# Altium schematic sheet PIN-HEADERS.SchDoc
size A; SheetNumber: 8; SheetTotal: 8
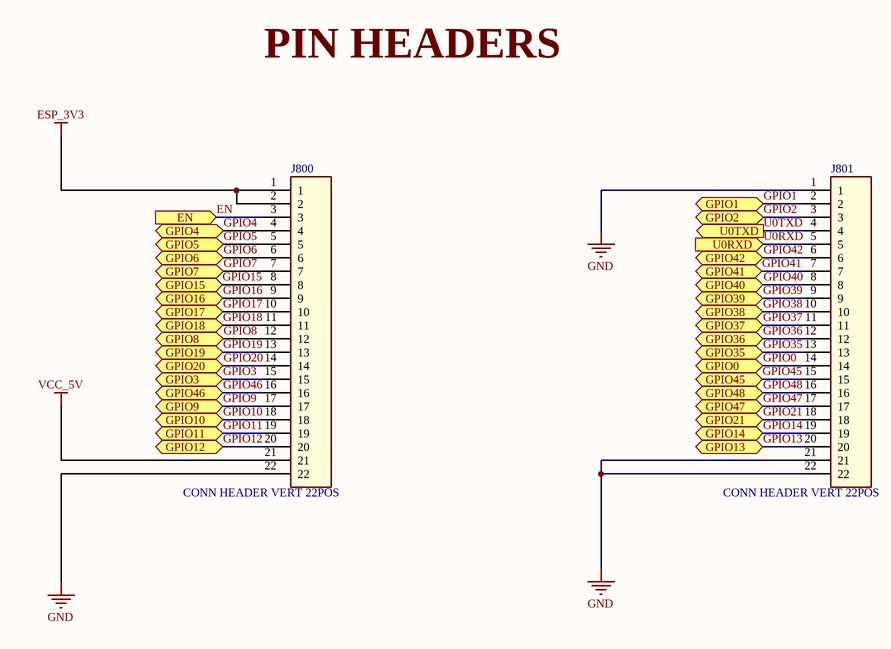
[diagram p0: PIN-HEADERS.SchDoc]

## Parts
J800  CONN HEADER VERT 22POS  [CON22_1X22_TU_TSW]
J801  CONN HEADER VERT 22POS  [CON22_1X22_TU_TSW]

## Ports
EN (in, see AUTO_PROGRAMMING[4B], ESP32-S3-WROOM-1U[2B], POWER[2C]), GPIO0 (bidir, see AUTO_PROGRAMMING[4C], ESP32-S3-WROOM-1U[4C], POWER[3C]), GPIO1 (bidir, see ESP32-S3-WROOM-1U[4B]), GPIO2 (bidir, see ESP32-S3-WROOM-1U[4B]), GPIO3 (bidir, see ESP32-S3-WROOM-1U[3A]), GPIO4 (bidir, see ESP32-S3-WROOM-1U[2B]), GPIO5 (bidir, see ESP32-S3-WROOM-1U[2B]), GPIO6 (bidir, see ESP32-S3-WROOM-1U[2B]), GPIO7 (bidir, see ESP32-S3-WROOM-1U[2B]), GPIO8 (bidir, see ESP32-S3-WROOM-1U[2B]), GPIO9 (bidir, see ESP32-S3-WROOM-1U[3A]), GPIO10 (bidir, see ESP32-S3-WROOM-1U[3A]), GPIO11 (bidir, see ESP32-S3-WROOM-1U[3A]), GPIO12 (bidir, see ESP32-S3-WROOM-1U[3A]), GPIO13 (bidir, see ESP32-S3-WROOM-1U[3A]), GPIO14 (bidir, see ESP32-S3-WROOM-1U[3A]), GPIO15 (bidir, see ESP32-S3-WROOM-1U[2B]), GPIO16 (bidir, see ESP32-S3-WROOM-1U[2B]), GPIO17 (bidir, see ESP32-S3-WROOM-1U[2B]), GPIO18 (bidir, see ESP32-S3-WROOM-1U[2B]), GPIO19 (bidir, see ESP32-S3-WROOM-1U[2B], USB[4A]), GPIO20 (bidir, see ESP32-S3-WROOM-1U[2C], USB[4A]), GPIO21 (bidir, see ESP32-S3-WROOM-1U[3A]), GPIO35 (bidir, see ESP32-S3-WROOM-1U[4B]), GPIO36 (bidir, see ESP32-S3-WROOM-1U[4B]), GPIO37 (bidir, see ESP32-S3-WROOM-1U[4B]), GPIO38 (bidir, see ESP32-S3-WROOM-1U[4B], RGB_LED[2B]), GPIO39 (bidir, see ESP32-S3-WROOM-1U[4B]), GPIO40 (bidir, see ESP32-S3-WROOM-1U[4B]), GPIO41 (bidir, see ESP32-S3-WROOM-1U[4B]), GPIO42 (bidir, see ESP32-S3-WROOM-1U[4B]), GPIO45 (bidir, see ESP32-S3-WROOM-1U[3A]), GPIO46 (bidir, see ESP32-S3-WROOM-1U[3A]), GPIO47 (bidir, see ESP32-S3-WROOM-1U[3A]), GPIO48 (bidir, see ESP32-S3-WROOM-1U[3A]), U0RXD (in, see ESP32-S3-WROOM-1U[4B], USB_TO_UART_CONVERTER[4A]), U0TXD (out, see ESP32-S3-WROOM-1U[4B], USB_TO_UART_CONVERTER[4A])

## Nets
ESP_3V3: J800.1 J800.2
GND: J800.22 J801.1 J801.21 J801.22
VCC_5V: J800.21
EN: J800.3 ; port EN
GPIO0: J801.14 ; port GPIO0
GPIO1: J801.2 ; port GPIO1
GPIO2: J801.3 ; port GPIO2
GPIO3: J800.15 ; port GPIO3
GPIO4: J800.4 ; port GPIO4
GPIO5: J800.5 ; port GPIO5
GPIO6: J800.6 ; port GPIO6
GPIO7: J800.7 ; port GPIO7
GPIO8: J800.12 ; port GPIO8
GPIO9: J800.17 ; port GPIO9
GPIO10: J800.18 ; port GPIO10
GPIO11: J800.19 ; port GPIO11
GPIO12: J800.20 ; port GPIO12
GPIO13: J801.20 ; port GPIO13
GPIO14: J801.19 ; port GPIO14
GPIO15: J800.8 ; port GPIO15
GPIO16: J800.9 ; port GPIO16
GPIO17: J800.10 ; port GPIO17
GPIO18: J800.11 ; port GPIO18
GPIO19: J800.13 ; port GPIO19
GPIO20: J800.14 ; port GPIO20
GPIO21: J801.18 ; port GPIO21
GPIO35: J801.13 ; port GPIO35
GPIO36: J801.12 ; port GPIO36
GPIO37: J801.11 ; port GPIO37
GPIO38: J801.10 ; port GPIO38
GPIO39: J801.9 ; port GPIO39
GPIO40: J801.8 ; port GPIO40
GPIO41: J801.7 ; port GPIO41
GPIO42: J801.6 ; port GPIO42
GPIO45: J801.15 ; port GPIO45
GPIO46: J800.16 ; port GPIO46
GPIO47: J801.17 ; port GPIO47
GPIO48: J801.16 ; port GPIO48
U0RXD: J801.5 ; port U0RXD
U0TXD: J801.4 ; port U0TXD

## Notes on the sheet
- PIN HEADERS

## Library data of the parts
J800 J801 = TSW-122-08-T-S: Connector Header Through Hole 22 position 0.100" (2.54mm); Mfr_Name: Samtec Inc; RefDes: RefDes; Type: Type